# EAGLE schematic teensy36-ubuntu-breakout (EAGLE 8.7.1)
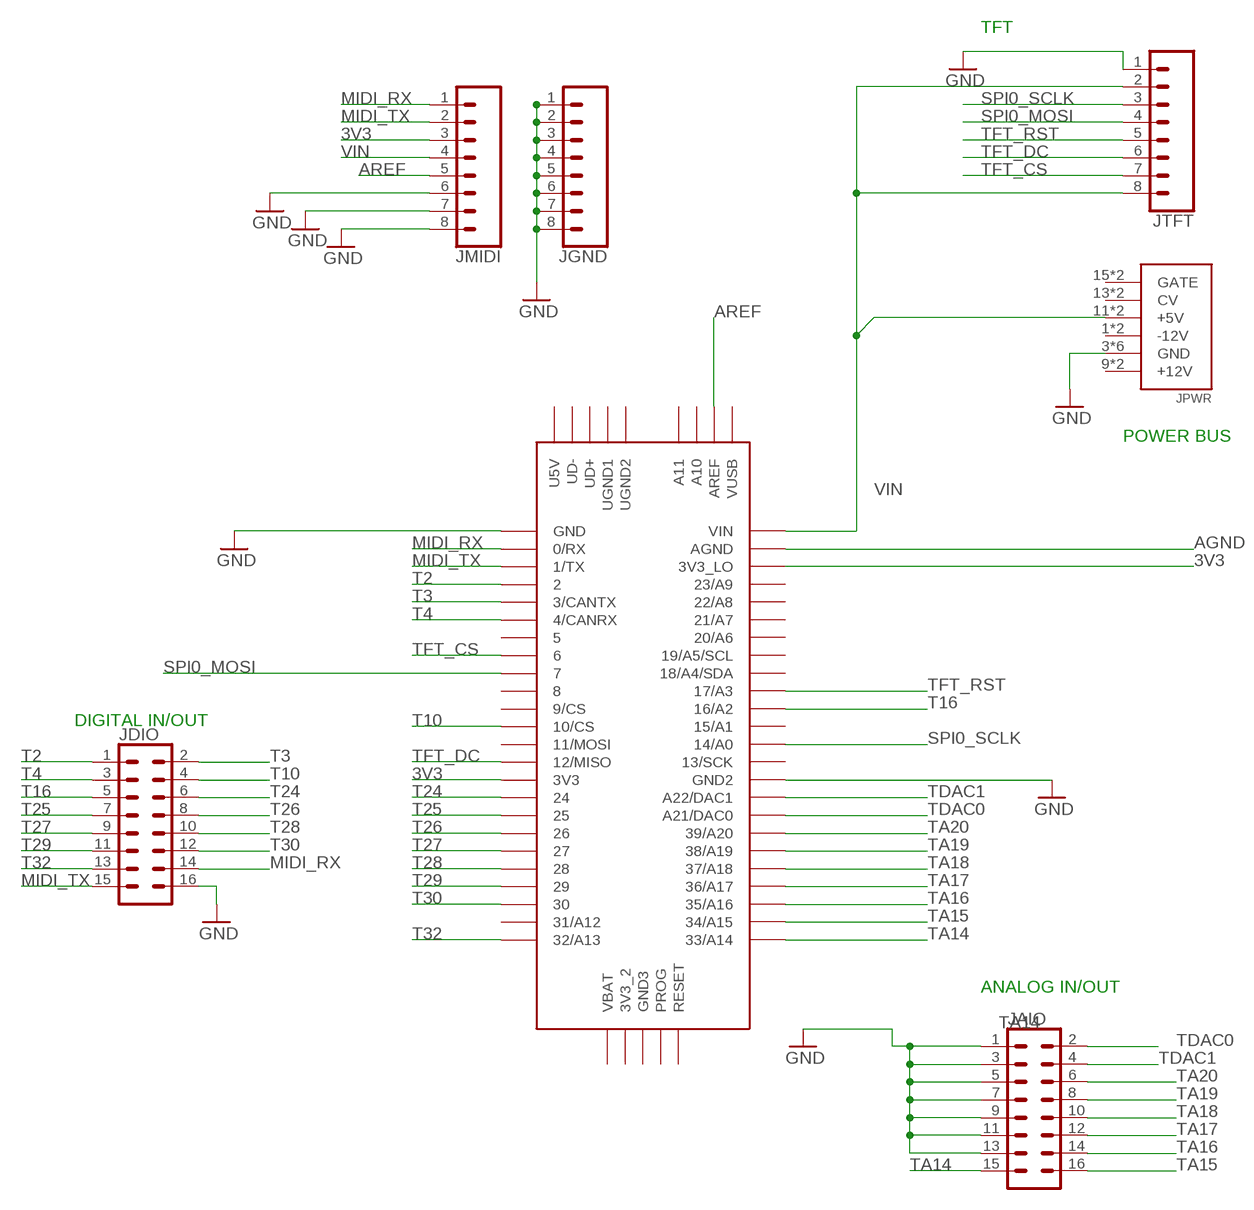
[diagram p0: schematic, sheet 1]

## Parts
JAIO  CONN_08X2  [2X8]
JDIO  CONN_08X2  [2X8]
JGND  CONN_08"  [1X08]
JMIDI  CONN_08"  [1X08]
JPWR  POWER  [POWER_16]
JTFT  CONN_08"  [1X08]
U$3  TEENSY_3.5/3.6  [TEENSY_3.5/3.6]

## Nets
3V3: JMIDI.3 U$3.3V3 U$3.3V3_LO
AGND: U$3.AGND
AREF: JMIDI.5 U$3.AREF
GND: JAIO.1 JAIO.3 JAIO.5 JAIO.7 JAIO.9 JAIO.11 JAIO.13 JDIO.16 JGND.1 JGND.2 JGND.3 JGND.4 JGND.5 JGND.6 JGND.7 JGND.8 JMIDI.6 JMIDI.7 JMIDI.8 JPWR.3(GND) JPWR.4(GND) JPWR.5(GND) JPWR.6(GND) JPWR.7(GND) JPWR.8(GND) JTFT.1 U$3.GND U$3.GND2
MIDI_RX: JDIO.14 JMIDI.1 U$3.0/RX
MIDI_TX: JDIO.15 JMIDI.2 U$3.1/TX
SPI0_MOSI: JTFT.4 U$3.7
SPI0_SCLK: JTFT.3 U$3.14/A0
T2: JDIO.1 U$3.2
T3: JDIO.2 U$3.3/CANTX
T4: JDIO.3 U$3.4/CANRX
T10: JDIO.4 U$3.10/CS
T16: JDIO.5 U$3.16/A2
T24: JDIO.6 U$3.24
T25: JDIO.7 U$3.25
T26: JDIO.8 U$3.26
T27: JDIO.9 U$3.27
T28: JDIO.10 U$3.28
T29: JDIO.11 U$3.29
T30: JDIO.12 U$3.30
T32: JDIO.13 U$3.32/A13
TA14: JAIO.15 U$3.33/A14
TA15: JAIO.16 U$3.34/A15
TA16: JAIO.14 U$3.35/A16
TA17: JAIO.12 U$3.36/A17
TA18: JAIO.10 U$3.37/A18
TA19: JAIO.8 U$3.38/A19
TA20: JAIO.6 U$3.39/A20
TDAC0: JAIO.2 U$3.21/DAC0(A21/DAC0)
TDAC1: JAIO.4 U$3.A22/DAC1
TFT_CS: JTFT.7 U$3.6
TFT_DC: JTFT.6 U$3.12/MISO
TFT_RST: JTFT.5 U$3.17/A3
VIN: JMIDI.4 JPWR.11(+5V) JPWR.12(+5V) JTFT.2 JTFT.8 U$3.VIN
Unconnected: JPWR.1(-12V) JPWR.2(-12V) JPWR.9(+12V) JPWR.10(+12V) JPWR.13(CV) JPWR.14(CV) JPWR.15(GATE) JPWR.16(GATE) U$3.3V3_2 U$3.5 U$3.8 U$3.9/CS U$3.11/MOSI U$3.13/SCK U$3.15/A1 U$3.18/A4/SDA U$3.19/A5/SCL U$3.20/A6 U$3.21/A7 U$3.22/A8 U$3.23/A9 U$3.31/A12 U$3.A10 U$3.A11 U$3.GND3 U$3.PROG U$3.RESET U$3.U5V U$3.UD+ U$3.UD- U$3.UGND1 U$3.UGND2 U$3.VBAT U$3.VUSB

## Notes on the sheet
- TFT
- POWER BUS
- DIGITAL IN/OUT
- ANALOG IN/OUT

## Library data of the parts
JAIO JDIO = SparkFun-Connectors:CONN_08X2: Multi connection point. Often used as Generic Header-pin footprint for 0.1 inch spaced/style header connections You can populate with any combo of single row headers, but if you'd like an exact match, check this: Header - 2x8 (Male, 0.1") <https://www.sparkfun.com/products/13156> (PRT-13156) On any of the 0.1 inch spaced packages, you can populate with these: Break Away Headers - Straight <https://www.sparkfun.com/products/116> (PRT-00116) Break Away Male Headers - Right Angle <https://www.sparkfun.com/products/553> (PRT-00553) Female Headers <https://www.sparkfun.com/products/115> (PRT-00115) Break Away Headers - Machine Pin <https://www.sparkfun.com/products/117> (PRT-00117) Break Away Female Headers - Swiss Machine Pin <https://www.sparkfun.com/products/743> (PRT-00743)
JGND JMIDI JTFT = SparkFun-Connectors:CONN_08: Multi connection point. Often used as Generic Header-pin footprint for 0.1 inch spaced/style header connections On any of the 0.1 inch spaced packages, you can populate with these: Break Away Headers - Straight <https://www.sparkfun.com/products/116> (PRT-00116) Break Away Male Headers - Right Angle <https://www.sparkfun.com/products/553> (PRT-00553) Female Headers <https://www.sparkfun.com/products/115> (PRT-00115) Break Away Headers - Machine Pin <https://www.sparkfun.com/products/117> (PRT-00117) Break Away Female Headers - Swiss Machine Pin <https://www.sparkfun.com/products/743> (PRT-00743) Arduino Stackable Header - 8 Pin <https://www.sparkfun.com/products/9279> (PRT-09279) For SCREWTERMINALS and SPRING TERMINALS visit here: Screw Terimnals on SparkFun.com <https://www.sparkfun.com/search/results?term=Screw+Terminals> (5mm/3.5mm/2.54mm spacing) This device is also useful as a general connection point to wire up your design to another part of your project. Our various solder wires solder well into these plated through hole pads. Hook-Up Wire - Assortment (Stranded, 22 AWG) <https://www.sparkfun.com/products/11375> (PRT-11375) Hook-Up Wire - Assortment (Solid Core, 22 AWG) <https://www.sparkfun.com/products/11367> (PRT-11367) View the entire wire category on our website here <https://www.sparkfun.com/categories/141> Special notes: Molex polarized connector foot print use with SKU : PRT-08231 with associated crimp pins and housings. 1MM SMD Version SKU: PRT-10208 NOTES ON THE VARIANTS LOCK and LOCK_LONGPADS... This footprint was designed to help hold the alignment of a through-hole component (i.e. 6-pin header) while soldering it into place. You may notice that each hole has been shifted either up or down by 0.005 of an inch from it's more standard position (which is a perfectly straight line). This slight alteration caused the pins (the squares in the middle) to touch the edges of the holes. Because they are alternating, it causes a "brace" to hold the component in place. 0.005 has proven to be the perfect amount of "off-center" position when using our standard breakaway headers. Although looks a little odd when you look at the bare footprint, once you have a header in there, the alteration is very hard to notice. Also,if you push a header all the way into place, it is covered up entirely on the bottom side.; PROD_ID: CONN-08438
JPWR = eurorack:POWER
U$3 = JC_Teensy356:TEENSY_3.5/3.6